# EAGLE design PushButtonDummy (EAGLE 6.4)
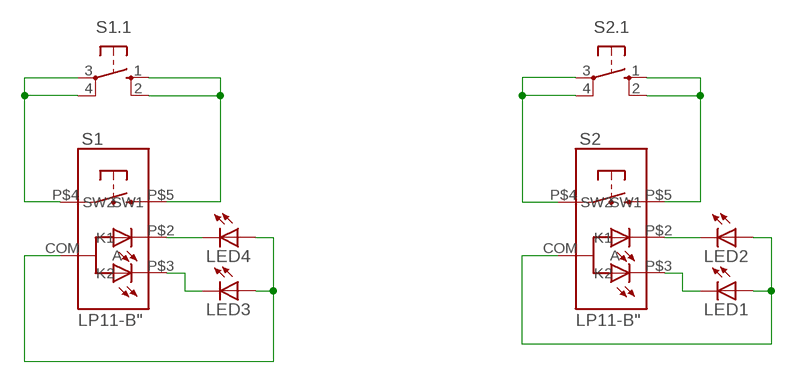
[diagram p0: schematic, sheet 1]

## Parts
LED1  LED3MM  [LED3MM]
LED2  LED3MM  [LED3MM]
LED3  LED3MM  [LED3MM]
LED4  LED3MM  [LED3MM]
S1  LP11-B"  [LP11]
S1.1  10-XX  [B3F-10XX]
S2  LP11-B"  [LP11]
S2.1  10-XX  [B3F-10XX]

## Nets
N$1: S1.1.3(P) S1.1.4(P1) S1.P$4(SW1)
N$2: S1.1.1(S) S1.1.2(S1) S1.P$5(SW2)
N$3: S2.1.1(S) S2.1.2(S1) S2.P$5(SW2)
N$4: S2.1.3(P) S2.1.4(P1) S2.P$4(SW1)
N$5: LED4.K(C) S1.P$2(K1)
N$6: LED3.K(C) S1.P$3(K2)
N$7: LED2.K(C) S2.P$2(K1)
N$8: LED1.K(C) S2.P$3(K2)
N$9: LED1.A LED2.A S2.COM(A)
N$10: LED3.A LED4.A S1.COM(A)

## Library data of the parts
LED1-LED4 = led:LED: LED OSRAM: - CHIPLED LG R971, LG N971, LY N971, LG Q971, LY Q971, LO R971, LY R971 LH N974, LH R974 LS Q976, LO Q976, LY Q976 LO Q996 - Hyper CHIPLED LW Q18S LB Q993, LB Q99A, LB R99A - SideLED LS A670, LO A670, LY A670, LG A670, LP A670 LB A673, LV A673, LT A673, LW A673 LH A674 LY A675 LS A676, LA A676, LO A676, LY A676, LW A676 LS A679, LY A679, LG A679 - Hyper Micro SIDELED® LS Y876, LA Y876, LO Y876, LY Y876 LT Y87S - SmartLED LW L88C, LW L88S LB L89C, LB L89S, LG L890 LS L89K, LO L89K, LY L89K LS L896, LA L896, LO L896, LY L896 - TOPLED LS T670, LO T670, LY T670, LG T670, LP T670 LSG T670, LSP T670, LSY T670, LOP T670, LYG T670 LG T671, LOG T671, LSG T671 LB T673, LV T673, LT T673, LW T673 LH T674 LS T676, LA T676, LO T676, LY T676, LB T676, LH T676, LSB T676, LW T676 LB T67C, LV T67C, LT T67C, LS T67K, LO T67K, LY T67K, LW E67C LS E67B, LA E67B, LO E67B, LY E67B, LB E67C, LV E67C, LT E67C LW T67C LS T679, LY T679, LG T679 LS T770, LO T770, LY T770, LG T770, LP T770 LB T773, LV T773, LT T773, LW T773 LH T774 LS E675, LA E675, LY E675, LS T675 LS T776, LA T776, LO T776, LY T776, LB T776 LHGB T686 LT T68C, LB T68C - Hyper Mini TOPLED® LB M676 - Mini TOPLED Santana® LG M470 LS M47K, LO M47K, LY M47K Source: http://www.osram.convergy.de LUXEON: - LUMILED® LXK2-PW12-R00, LXK2-PW12-S00, LXK2-PW14-U00, LXK2-PW14-V00 LXK2-PM12-R00, LXK2-PM12-S00, LXK2-PM14-U00 LXK2-PE12-Q00, LXK2-PE12-R00, LXK2-PE12-S00, LXK2-PE14-T00, LXK2-PE14-U00 LXK2-PB12-K00, LXK2-PB12-L00, LXK2-PB12-M00, LXK2-PB14-N00, LXK2-PB14-P00, LXK2-PB14-Q00 LXK2-PR12-L00, LXK2-PR12-M00, LXK2-PR14-Q00, LXK2-PR14-R00 LXK2-PD12-Q00, LXK2-PD12-R00, LXK2-PD12-S00 LXK2-PH12-R00, LXK2-PH12-S00 LXK2-PL12-P00, LXK2-PL12-Q00, LXK2-PL12-R00 Source: www.luxeon.com KINGBRIGHT: KA-3528ASYC Source: www.kingbright.com
S1 S2 = SKAARHOJ:LP11-B
S1.1 S2.1 = switch-omron:10-XX: OMRON SWITCH; MPN: B3F-1000; OC_FARNELL: 176432; OC_NEWARK: 36M3542

## Board
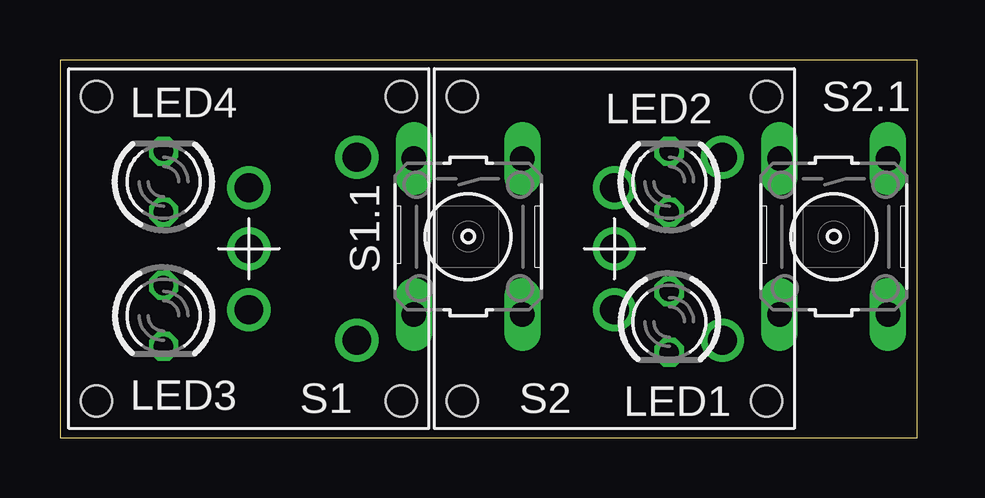
[diagram p1: board, top side]
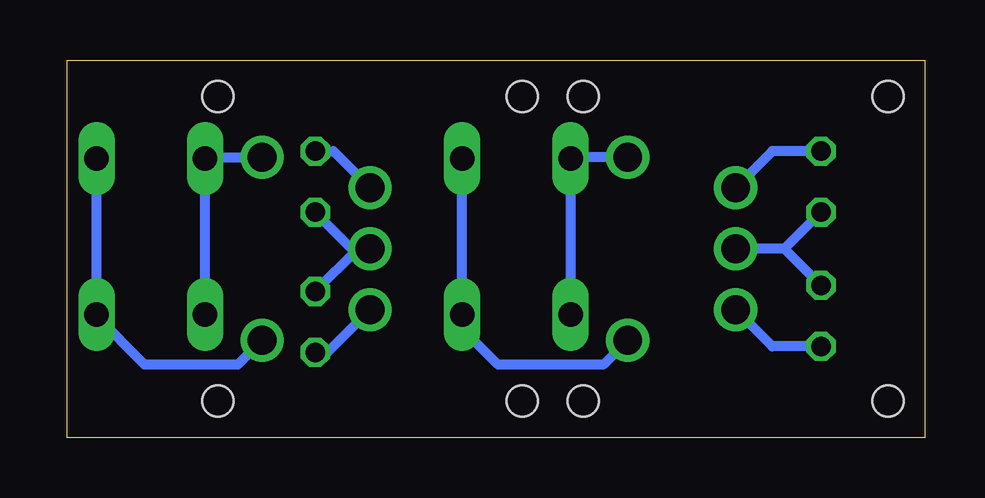
[diagram p2: board, bottom side, seen from below]

Size 35.74 x 15.74 mm. Coordinates in mm from the lower left corner, seen from the top.
Outline: 0,0 35.74,0 35.74,15.74 0,15.74 0,0
Copper layers (1*16): Top 0.0356mm / dielectric 1.5011mm / Bottom 0.0356mm
Design rules "OshPark_PCBOrder": minimum track width 6mil, minimum drill 13mil, track to track 6mil, track to pad 6mil, pad to pad 6mil, via to via 6mil, smd to smd 6mil, copper to edge 15mil, drill to drill 6mil, minimum pad ring 7mil, minimum via ring 7mil, stop-mask expansion 4mil, vias tented up to drill 0mil, thermal gap 10mil

### Footprints (pad centres in the part's own frame; a part is rotated, then mirrored left to right if it is on the bottom)
LED3MM = drill 0.813 octagon: A -1.27,0; K 1.27,0
LP11 = drill 1.2: COM 0,0; P$2 0,2.54; P$3 0,-2.54; P$4 4.5,3.81; P$5 4.5,-3.81 | hole 1.3: -6.35,6.35; 6.35,6.35; 6.35,-6.35; -6.35,-6.35
B3F-10XX = drill 1.016 long: 1 -3.251,2.261; 2 3.251,2.261; 3 -3.251,-2.261; 4 3.251,-2.261

### Placement (x,y rotation side)
LED1  25.4,4.83 270 top
LED2  25.4,10.67 90 top
LED3  4.32,5.08 270 top
LED4  4.32,10.67 90 top
S1  7.87,7.87 0 top
S1.1  17.02,8.38 270 top
S2  23.11,7.87 0 top
S2.1  32.26,8.38 270 top

### Tracks (layer width: path | path; a pad name or v marks a point on that pad's centre or on a via)
N$1
  Bottom 0.406: S1.P$4 14.2,11.68 S1.1.3 S1.1.4
N$2
  Bottom 0.406: S1.1.1 S1.1.2 19.28,4.55 17.78,3.05 13.39,3.05 S1.P$5
N$3
  Bottom 0.406: S2.1.1 S2.1.2 34.52,5.05 32.51,3.05 28.63,3.05 S2.P$5
N$4
  Bottom 0.406: S2.1.4 S2.1.3 29.44,11.68 S2.P$4
N$5
  Bottom 0.406: LED4.K 6.35,11.94 S1.P$2
N$6
  Bottom 0.406: LED3.K 6.35,3.81 S1.P$3
N$7
  Bottom 0.406: LED2.K 24.64,11.94 S2.P$2
N$8
  Bottom 0.406: S2.P$3 24.89,3.56 LED1.K
N$9
  Bottom 0.406: LED1.A 23.62,7.87 S2.COM 23.88,7.87 LED2.A
N$10
  Bottom 0.406: LED3.A 5.84,7.87 | LED4.A 5.84,7.87 | 5.84,7.87 S1.COM